# Altium schematic sheet joint_board_boosterpack_motor_drivers.SchDoc
size A; DocumentNumber: 5
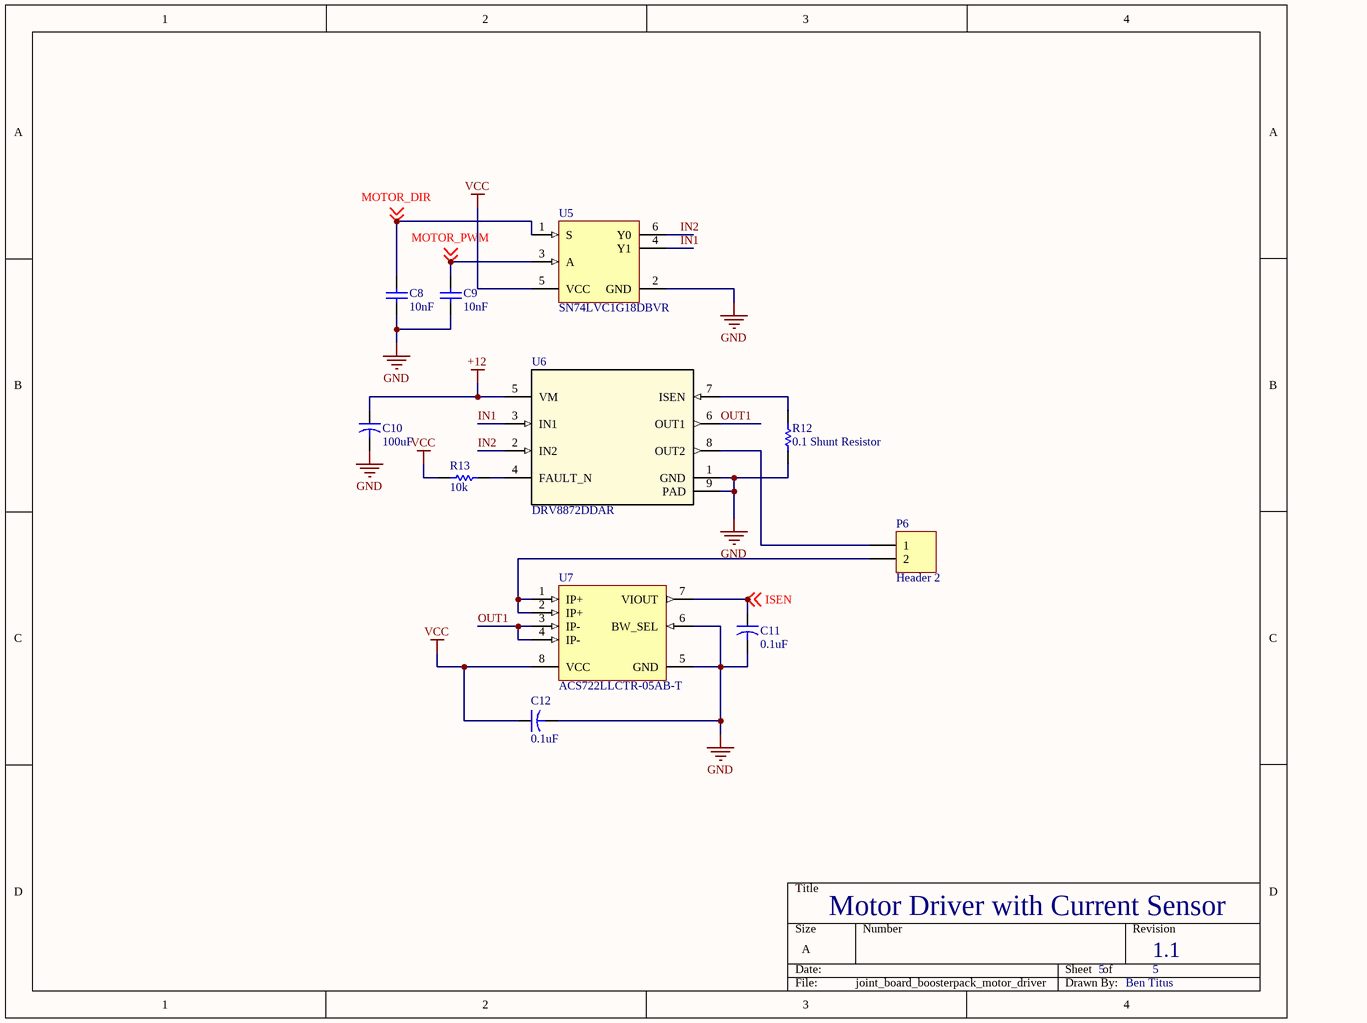
[diagram p0: joint_board_boosterpack_motor_drivers.SchDoc]

## Parts
C8  10nF  [CAPC0805(2012)145_L]
C9  10nF  [CAPC0805(2012)145_L]
C10  100uF  [CAPR5-4X5]
C11  0.1uF  [CAPR5-4X5]
C12  0.1uF  [CAPR5-4X5]
P6  Header 2  [HDR1X2]
R12  0.1 Shunt Resistor  [RESC2512(6432)_L]
R13  10k  [RESC0805(2012)_L]
U5  SN74LVC1G18DBVR  [DBV0006A_L]
U6  DRV8872DDAR  [DDA0008H_N]
U7  ACS722LLCTR-05AB-T  [ALEG-LC-8_V]

## Nets
+12: C10.1 U6.5(VM)
GND: C8.1 C9.1 C10.2 C11.2 C12.2 R12.1 U5.2(GND) U6.1(GND) U6.9(PAD) U7.5(GND) U7.6(BW_SEL)
VCC: C12.1 R13.1 U5.5(VCC) U7.8(VCC)
IN1: U5.4(Y1) U6.3(IN1)
IN2: U5.6(Y0) U6.2(IN2)
ISEN: C11.1 U7.7(VIOUT) ; off-sheet ISEN
MOTOR_DIR: C8.2 U5.1(S) ; off-sheet MOTOR_DIR
MOTOR_PWM: C9.2 U5.3(A) ; off-sheet MOTOR_PWM
OUT1: U6.6(OUT1) U7.3(IP-) U7.4(IP-)
NetP6_1: P6.1 U6.8(OUT2)
NetP6_2: P6.2 U7.1(IP+) U7.2(IP+)
NetR12_2: R12.2 U6.7(ISEN)
NetR13_2: R13.2 U6.4(FAULT_N)

## Notes on the sheet
- Motor Driver with Current Sensor
- 5
- 1.1
- Ben Titus

## Library data of the parts
C8 C9 = CMP-1590-00003-1: 0805 (2012 Metric) Chip Capacitor; Case-EIA: 0805; Case-Metric: 2012; PackageReference: CAPC0805(2012)145
C10 = Cap2: 100uF Filter Capacitor; Published: 23-Sep-2002; PackageReference: CAPR5-4X5; Publisher: Altium Limited; PackageDescription: Capacitor; 2 Leads; Value: 100uF
C11 C12 = Cap2: Capacitor; Published: 23-Sep-2002; PackageReference: CAPR5-4X5; Publisher: Altium Limited; PackageDescription: Capacitor; 2 Leads; Value: 0.1uF
P6 = Header 2: Header, 2-Pin; LatestRevisionDate: 17-Jul-2002; LatestRevisionNote: Re-released for DXP Platform.; Publisher: Altium Limited
R12 = CMP-1591-00007-1: 2512 (6432 Metric) Chip Resistor; Case-EIA: 2512; Case-Metric: 6432; PackageReference: RESC2512(6432)
R13 = CMP-1591-00002-1: 0805 (2012 Metric) Chip Resistor; Case-EIA: 0805; Case-Metric: 2012; PackageReference: RESC0805(2012)
U5 = CMP-0859-00184-3: One of Two Noninverting Demultiplexer with 3-State Deselected Output, DBV0006A, LARGE T&R; Manufacturer: Texas Instruments; Technology Family: LVC; Specialty Logic Family: Decoder/Encoder/Multiplexer; 3-State Output: No; F @ Nom Voltage(Max)(Mhz): 150; VCC(Max)(V): 5.5; Rating: Catalog; Logic: True; Output Type: CMOS; Voltage(Nom)(V): 1.8,2.5,3.3,5; Output Drive (IOL/IOH)(Max)(mA): 32/-32; tpd @ Nom Voltage(Max)(ns): 9.3,5,4.2,3.2; Input Type: CMOS/TTL; Bits(#): 1; ICC @ Nom Voltage(Max)(mA): 0.01; VCC(Min)(V): 1.65; Generic Part Number: SN74LVC1G18; Operating Temperature Range(C): -40 to 85; Sub-Family: Decoder/Encoder/Multiplexer; PackageReference: DBV0006A; DatasheetVersion: SCES406K; Schmitt Trigger: No
U6 = DRV8872DDAR: Imported; Manufacturer: Texas Instruments; CompType: IC; PIN_COUNT: 9; PartNumber: DRV8872DDAR; Alternate_PartNumber: DRV8872DDA; PackageReference: DDA0008H; MountType: SMT; RefDes: RefDes; TYPE: TYPE; Value: Value
U7 = CMP-1557-00006-1: High Accuracy, Galvanically Isolated Current Sensor IC, 3 to 3.6 V, -5 to 5 A IP, -40 to 150 degC, 8-Pin SOIC (LC), RoHS, Tape and Reel; VCC Min: 3 V; IP Max: 5 A; IP Min: -5 A; VCC Max: 3.6 V; ComponentLink3URL: http://www.allegromicro.com/~/media/Files/Datasheets/ACS711-Datasheet.ashx?la=en; RoHS: TRUE; PartNumber: ACS722LLCTR-05AB-T; ComponentLink1Description: Manufacturer URL; ComponentLink1URL: http://www.allegromicro.com/; ComponentLink3Description: Package Specification; Temperature Min: -40 degC; Packing: Tape and Reel; PackageDescription: 8-Pin Small Outline Integrated Package, Body 4.9 x 3.9 mm, Pitch 1.27 mm; ComponentLink2URL: http://www.allegromicro.com/~/media/Files/Datasheets/ACS722-Datasheet.ashx?la=en; Mounting Technology: Surface Mount; Temperature Max: 150 degC; ComponentLink2Description: Datasheet